# EasyEDA Pro project ProPrj_Dolphin 3D.epro, schematic Schematic1
Board Name: Main Board; Create Date: 2024-06-27; Page Name: P1; Project Name: Dolphin 3D; Schematic Name: Schematic1; Update Date: 2024-09-18
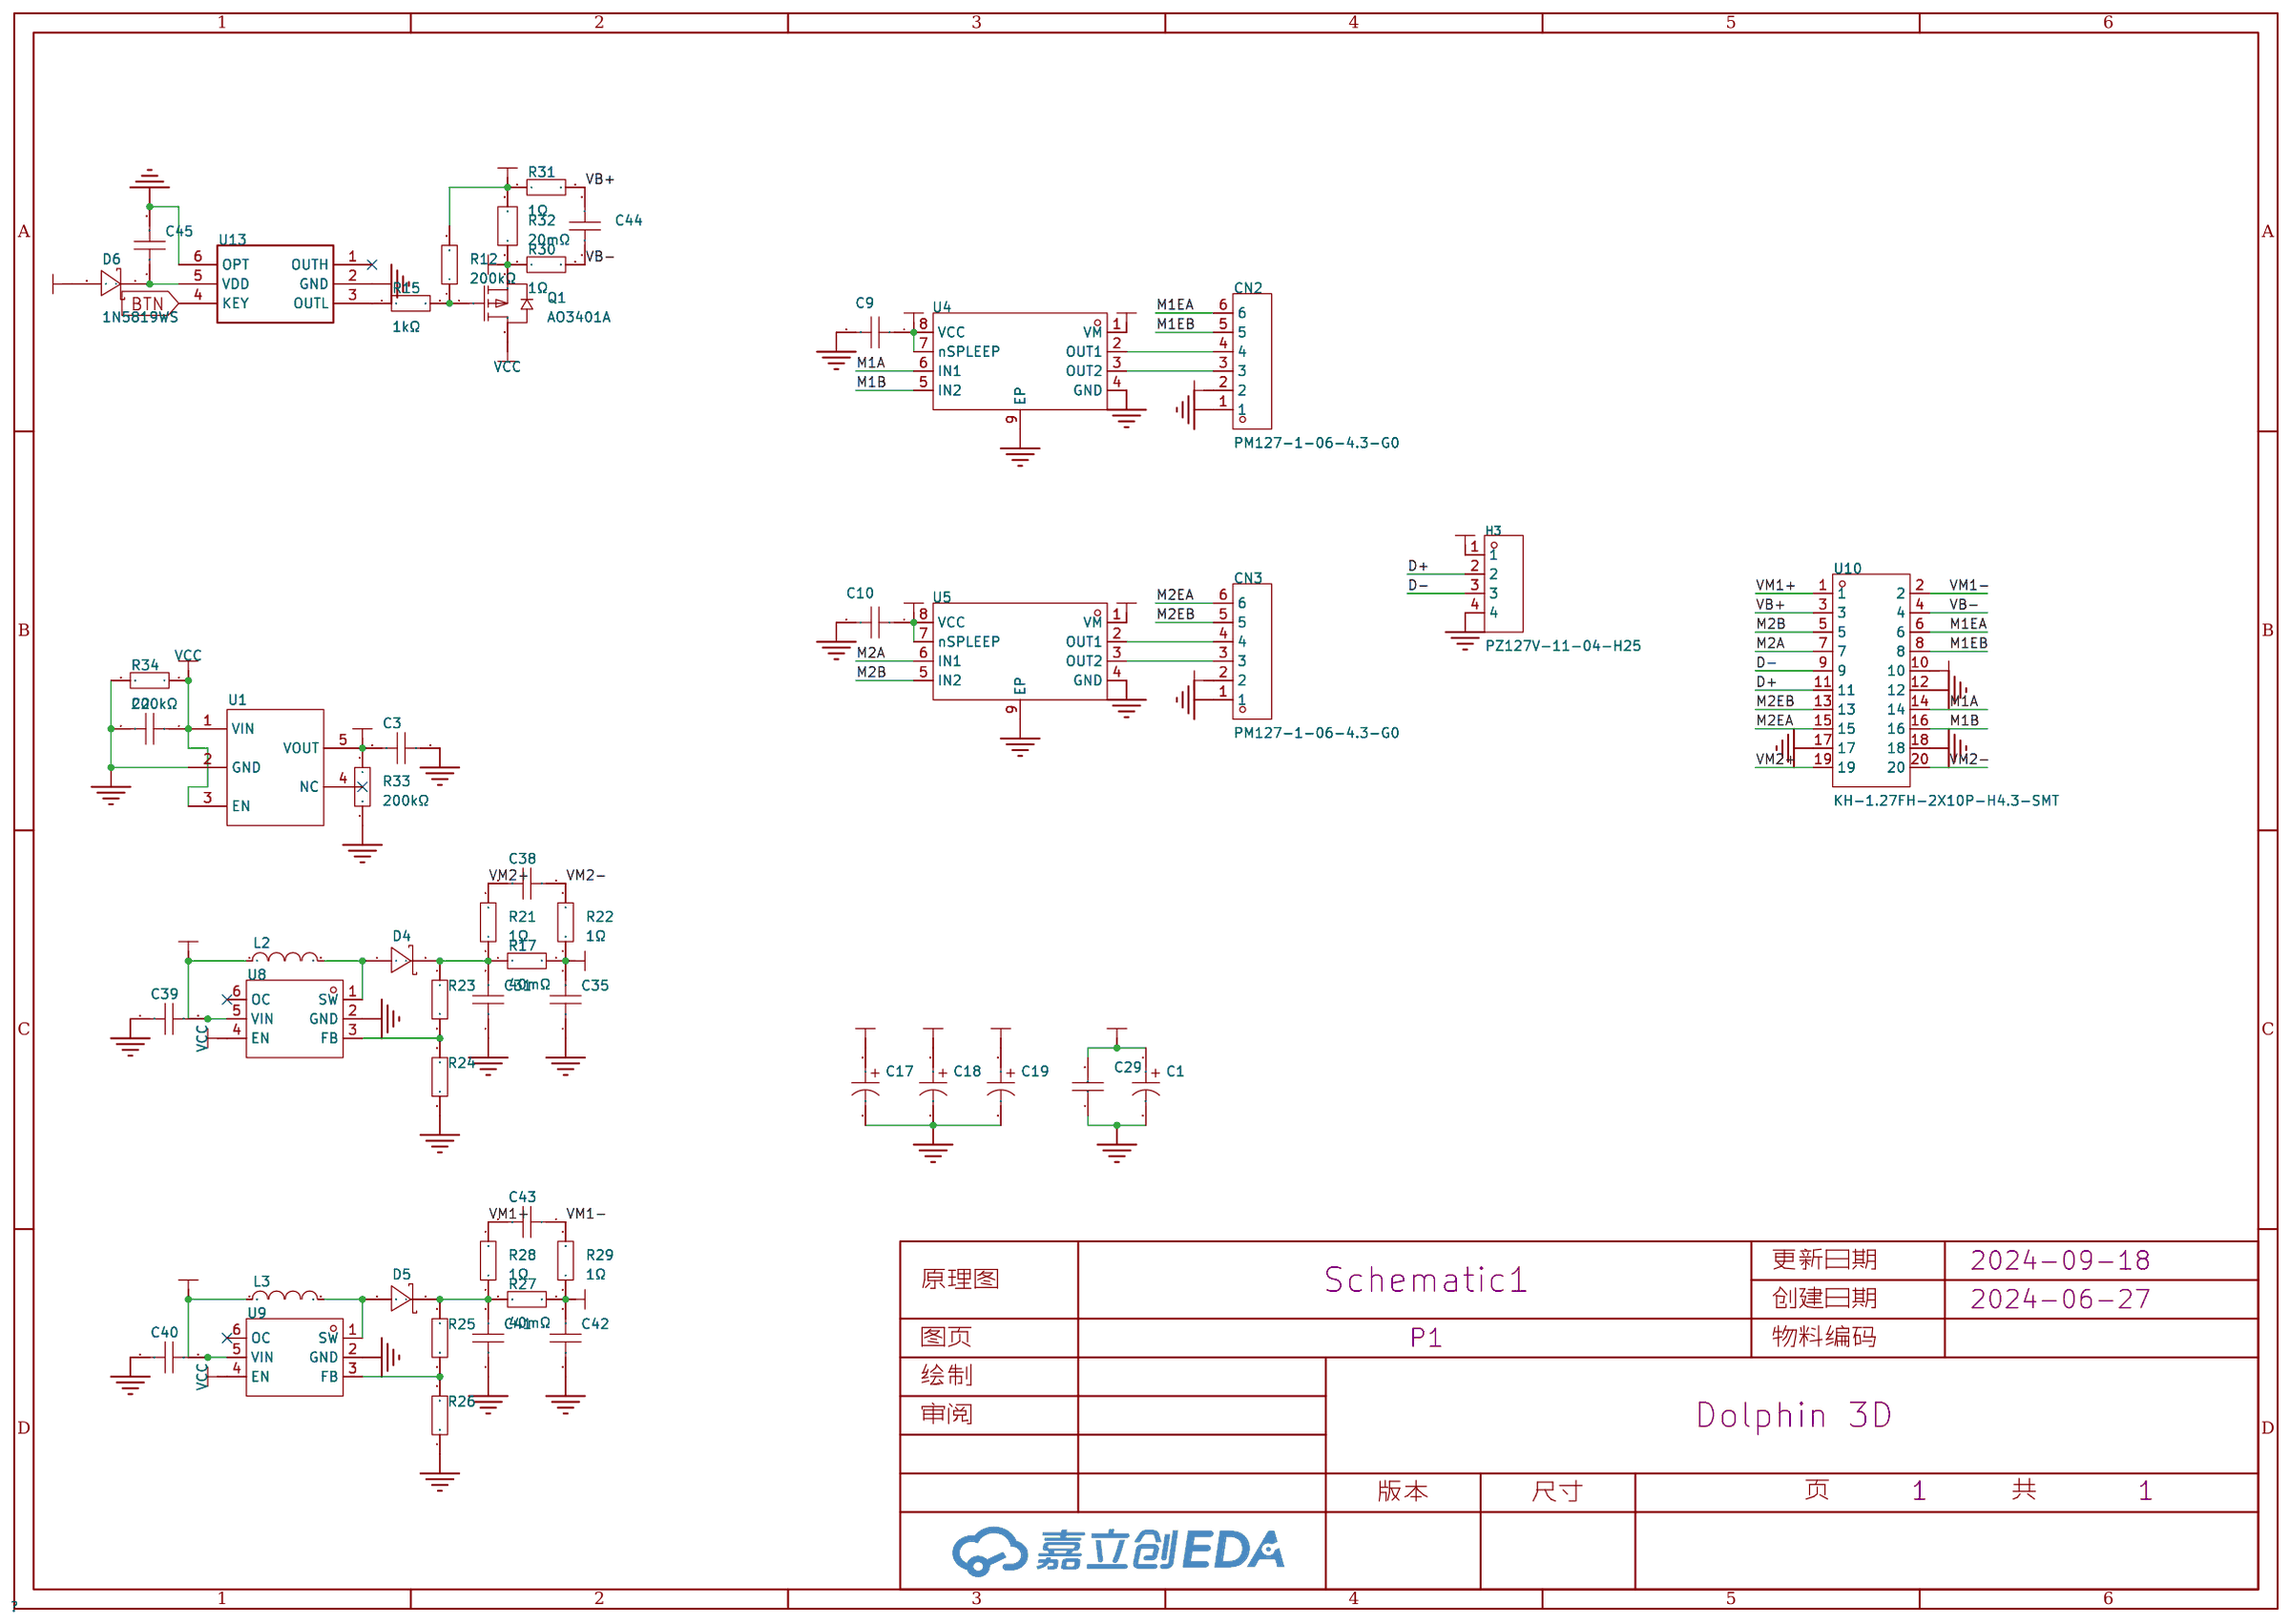
[diagram p0: schematic sheet]

## Parts
C1  470uF  [CAP-SMD_BD6.3-L6.6-W6.6-FD]
C2  1uF  [C0402]
C3  1uF  [C0402]
C9  100nF  [C0402]
C10  100nF  [C0402]
C17  470uF  [CAP-SMD_BD6.3-L6.6-W6.6-FD]
C18  470uF  [CAP-SMD_BD6.3-L6.6-W6.6-FD]
C19  470uF  [CAP-SMD_BD6.3-L6.6-W6.6-FD]
C29  100uF  [C1206]
C31  22uF  [C0805]
C35  22uF  [C0805]
C38  100nF  [C0402]
C39  22uF  [C0805]
C40  22uF  [C0805]
C41  22uF  [C0805]
C42  22uF  [C0805]
C43  100nF  [C0402]
C44  100nF  [C0402]
C45  10uF  [C0402]
CN2  PM127-1-06-4.3-G0  [HDR-TH_6P-P1.27-V-F]
CN3  PM127-1-06-4.3-G0  [HDR-TH_6P-P1.27-V-F]
D4  SS54  [SMA_L4.4-W2.8-LS5.4-R-RD]
D5  SS54  [SMA_L4.4-W2.8-LS5.4-R-RD]
D6  1N5819WS  [SOD-323_L1.8-W1.3-LS2.5-RD]
H3  PZ127V-11-04-H25  [HDR-TH_4P-P1.27-V-M]
L2  6.8uH  [IND-SMD_L4.0-W4.0_FNR4012S]
L3  6.8uH  [IND-SMD_L4.0-W4.0_FNR4012S]
Q1  AO3401A  [SOT-23_L2.9-W1.3-P1.90-LS2.4-BR]
R12  200kΩ  [R0402]
R15  1kΩ  [R0402]
R17  40mΩ  [R0805]
R21  1Ω  [R0402]
R22  1Ω  [R0402]
R23  174kΩ  [R0402]
R24  10kΩ  [R0402]
R25  174kΩ  [R0402]
R26  10kΩ  [R0402]
R27  40mΩ  [R0805]
R28  1Ω  [R0402]
R29  1Ω  [R0402]
R30  1Ω  [R0402]
R31  1Ω  [R0402]
R32  20mΩ  [R1206]
R33  200kΩ  [R0402]
R34  200kΩ  [R0402]
U1  RT9013-33GB  [SOT-23-5_L3.0-W1.7-P0.95-LS2.8-BL]
U4  DRV8837DSGR  [WSON-8_L2.0-W2.0-P0.50-TL-EP]
U5  DRV8837DSGR  [WSON-8_L2.0-W2.0-P0.50-TL-EP]
U8  MT3608L  [SOT-23-6_L2.9-W1.7-P0.95-LS2.8-BL]
U9  MT3608L  [SOT-23-6_L2.9-W1.7-P0.95-LS2.8-BL]
U10  KH-1.27FH-2X10P-H4.3-SMT  [CONN-SMD_20P-P1.27_KINGHELM_KH-1.27FH-2X10P-H4.3-SMT]
U13  -  [SOT-23-6_L2.9-W1.6-P0.95-LS2.8-BL]

## Library data of the parts
C1 C17-C19 = 126RV0010: 容值:470uF;精度:±20%;额定电压:16V;纹波电流:175mA@120Hz;等效串联电阻:-;; LCSC Part Name: 470uF ±20% 16V; Supplier Part: C5354997; Manufacturer: KNSCHA(科尼盛); Supplier Footprint: SMD,D6.3xL7.7mm; JLCPCB Part Class: Extended Part; Datasheet: https://atta.szlcsc.com/upload/public/pdf/source/20230206/6EACB8087E386B8E2A41225BA5FD94C3.pdf; Supplier: LCSC; Tolerance: ±20%; Rated Voltage: 16V; Ripple Current: 175mA@120Hz; φD: 6.3mm; L: 7.7mm; Lifetime @ Temp: 2000hrs@105; Operating Temperature: -55~+105
C2 C3 = CL05A105KA5NQNC: 容值:1uF;精度:±10%;额定电压:25V;材质(温度系数):X5R;; LCSC Part Name: 1uF ±10% 25V; Supplier Part: C52923; Manufacturer: SAMSUNG(三星); Supplier Footprint: 0402; JLCPCB Part Class: Basic Part; Datasheet: https://atta.szlcsc.com/upload/public/pdf/source/20160218/1457707763339.pdf; Supplier: LCSC; Tolerance: ±10%; Voltage Rated: 25V; Temperature Coefficient: X5R
C9 C10 C38 C43 C44 = CL05B104KB54PNC: 容值:100nF;精度:±10%;额定电压:50V;材质(温度系数):X7R;; LCSC Part Name: 100nF ±10% 50V; Supplier Part: C307331; Manufacturer: SAMSUNG(三星); Supplier Footprint: 0402; JLCPCB Part Class: Basic Part; Datasheet: https://atta.szlcsc.com/upload/public/pdf/source/20160218/1457707763339.pdf; Supplier: LCSC; Tolerance: ±10%; Voltage Rated: 50V; Temperature Coefficient: X7R
C29 = CL31A107MQHNNNE: 容值:100uF;精度:±20%;额定电压:6.3V;材质(温度系数):X5R;; LCSC Part Name: 100uF ±20% 6.3V; Supplier Part: C15008; Manufacturer: SAMSUNG(三星); Supplier Footprint: 1206; JLCPCB Part Class: Basic Part; Datasheet: https://atta.szlcsc.com/upload/public/pdf/source/20160218/1457707763339.pdf; Supplier: LCSC; Tolerance: ±20%; Voltage Rated: 6.3V; Temperature Coefficient: X5R
C31 C35 C39-C42 = CL21A226MAQNNNE: 容值:22uF;精度:±20%;额定电压:25V;材质(温度系数):X5R;; LCSC Part Name: 22uF ±20% 25V; Supplier Part: C45783; Manufacturer: SAMSUNG(三星); Supplier Footprint: 0805; JLCPCB Part Class: Basic Part; Datasheet: https://atta.szlcsc.com/upload/public/pdf/source/20160218/1457707763339.pdf; Supplier: LCSC; Tolerance: ±20%; Voltage Rated: 25V; Temperature Coefficient: X5R
C45 = CL05A106MQ5NUNC: 容值:10uF;精度:±20%;额定电压:6.3V;材质(温度系数):X5R;; LCSC Part Name: 10uF ±20% 6.3V; Supplier Part: C15525; Manufacturer: SAMSUNG(三星); Supplier Footprint: 0402; JLCPCB Part Class: Basic Part; Datasheet: https://atta.szlcsc.com/upload/public/pdf/source/20220823/2B02EE04F8F211D38A52DCB16EB6BEBA.pdf; Supplier: LCSC; Tolerance: ±20%; Voltage Rated: 6.3V; Temperature Coefficient: X5R
CN2 CN3 = PM127-1-06-4.3-G0: 插孔结构:1x6P;间距:1.27mm;行距:-;圆孔/方孔:方孔;安装类型:直插;排数:单排;总孔位数:6P;额定电流:1A;插孔方向:顶部;塑高:4.3mm;触头材质:磷青铜;工作温度范围:-40℃~+105℃;焊接温度(最大值):260℃@10S;; LCSC Part Name: 1x6P 间距:1.27mm 直插; Supplier Part: C5447364; Manufacturer: HCTL(华灿天禄); Supplier Footprint: 插件,P=1.27mm; JLCPCB Part Class: Extended Part; Datasheet: https://atta.szlcsc.com/upload/public/pdf/source/20230412/FDFD02C4BDBEFFD68C1CF22FAB47C8A5.pdf; Supplier: LCSC; Holes Structure: 1x6P; Pitch: 1.27mm; Circular Hole / Square Hole: 方孔; Mounting Type: 直插; Number of Rows: 单排; Number of Holes: 6P; Current Rating (Max): 1A; Holes Direction: 顶部; Insulation Height: 4.3mm; Contact Material: 磷青铜; Operating Temperature Range: -40℃~+105℃; Soldering Temperature(Max): 260℃@10S
D4 D5 = SS54_C22452: 二极管配置:独立式;正向压降(Vf):550mV@5A;直流反向耐压(Vr):40V;整流电流:5A;; LCSC Part Name: 电压:40V 电流:5A; Supplier Part: C22452; Manufacturer: MDD(辰达半导体); Supplier Footprint: SMA(DO-214AC); JLCPCB Part Class: Basic Part; Datasheet: https://atta.szlcsc.com/upload/public/pdf/source/20230314/529CD85F9B31F69841D3A079BC07E377.pdf; Supplier: LCSC; Diode Configuration: 独立式; Forward Voltage (Vf@If): 550mV@5A; Reverse Voltage (Vr): 40V; Rectified Current: 5A; Reverse Leakage Current (Ir): 1mA@40V; Average Rectified Current (Io): 5A
D6 = 1N5819WS_C191023: 正向压降(Vf):600mV@1A;直流反向耐压(Vr):40V;平均整流电流(Io):1A;; LCSC Part Name: 电压:40V 电流:1A; Supplier Part: C191023; Manufacturer: Hottech(合科泰); Supplier Footprint: SOD-323; JLCPCB Part Class: 基础库; Datasheet: https://atta.szlcsc.com/upload/public/pdf/source/20220428/3CB86FD8D28D653594B4E35F9D5AEFD9.pdf; Supplier: LCSC; Forward Voltage (Vf@If): 600mV@1A; Reverse Voltage (Vr): 40V; Average Rectified Current (Io): 1A
H3 = PZ127V-11-04-H25: 插针结构:1x4P;间距:1.27mm;行距:-;圆针/方针:方针;安装类型:直插;排数:单排;总PIN位数:4P;额定电流:1A;额定电压:-;配合针长度:2.9mm;塑高:2.5mm;端接针长度:2mm;触头材质:-;工作温度范围:-40℃~+105℃;颜色:黑色;; LCSC Part Name: 间距:1.27mm 1x4P 直插 方针; Supplier Part: C962328; Manufacturer: XFCN(兴飞); Supplier Footprint: 插件,P=1.27mm; JLCPCB Part Class: 扩展库; Datasheet: https://atta.szlcsc.com/upload/public/pdf/source/20201127/C962328_DAA4922208AAB130BB0C2B7AF8550114.pdf; Supplier: LCSC; Pin Structure: 1x4P; Pitch: 1.27mm; Circluar Pins/Square Pins: 方针; Mounting Type: 直插; Number of Rows: 单排; Number of Pins: 4P; Current Rating (Max): 1A; Length of Mating Pin: 2.9mm; Insulation Height: 2.5mm; Length of End Connection Pin: 2mm; Operating Temperature Range: -40℃~+105℃; Color: 黑色
L2 L3 = SMNR4030-6R8MT: 电感值:6.8uH;精度:±20%;额定电流:2.6A;饱和电流(Isat):2.6A;; LCSC Part Name: 6.8uH ±20% 2.6A; Supplier Part: C5307592; Manufacturer: SXN(顺翔诺); Supplier Footprint: SMD,4x4x3mm; JLCPCB Part Class: Extended Part; Datasheet: https://atta.szlcsc.com/upload/public/pdf/source/20210810/9B14FB057739B11AB42B77A310A3EA3C.pdf; Supplier: LCSC; Tolerance: ±20%; Rated Current: 2.6A; Saturation Current (Isat): 2.6A; DC Resistance (DCR): 115mΩ
Q1 = AO3401A_C15127: 类型:1个P沟道;漏源电压(Vdss):30V;连续漏极电流(Id):4A;功率(Pd):1.4W;导通电阻(RDS(on)@Vgs,Id):44mΩ@10V,4.3A;阈值电压(Vgs(th)@Id):1.3V@250uA;; LCSC Part Name: 1个P沟道 耐压:30V 电流:4A; Supplier Part: C15127; Manufacturer: AOS; Supplier Footprint: SOT-23; JLCPCB Part Class: 基础库; Datasheet: https://atta.szlcsc.com/upload/public/pdf/source/20160507/1462613609053.pdf; Supplier: LCSC; Type: 1个P沟道; Drain Source Voltage (Vdss): 30V; Continuous Drain Current (Id): 4A; Power Dissipation (Pd): 1.4W; Drain Source On Resistance (RDS(on)@Vgs,Id): 44mΩ@10V,4.3A; Gate Threshold Voltage (Vgs(th)@Id): 1.3V@250uA; Total Gate Charge (Qg@Vgs): 12.2nC@4.5V; Input Capacitance (Ciss@Vds): 1.2nF@15V; Operating Temperature: -55℃~+150℃@(Tj)
R12 R33 R34 = 0402WGF2003TCE: 电阻类型:厚膜电阻;阻值:200kΩ;精度:±1%;功率:62.5mW;最大工作电压:50V;温度系数:±100ppm/℃;; LCSC Part Name: 200kΩ ±1% 62.5mW 厚膜电阻; Supplier Part: C25764; Manufacturer: UNI-ROYAL(厚声); Supplier Footprint: 0402; JLCPCB Part Class: Basic Part; Datasheet: https://atta.szlcsc.com/upload/public/pdf/source/20200306/C422600_1E6D84923E4A46A82E41ADD87F860B5C.pdf; Supplier: LCSC; Type: 厚膜电阻; Tolerance: ±1%; Power(Watts): 62.5mW; Overload Voltage (Max): 50V; Temperature Coefficient: ±100ppm/℃; Operating Temperature Range: -55℃~+155℃
R15 = 0402WGF1001TCE: 电阻类型:厚膜电阻;阻值:1kΩ;精度:±1%;功率:62.5mW;最大工作电压:50V;温度系数:±100ppm/℃;; LCSC Part Name: 1kΩ ±1% 62.5mW 厚膜电阻; Supplier Part: C11702; Manufacturer: UNI-ROYAL(厚声); Supplier Footprint: 0402; JLCPCB Part Class: 基础库; Datasheet: https://atta.szlcsc.com/upload/public/pdf/source/20200306/C422600_1E6D84923E4A46A82E41ADD87F860B5C.pdf; Supplier: LCSC; Type: 厚膜电阻; Tolerance: ±1%; Power(Watts): 62.5mW; Overload Voltage (Max): 50V; Temperature Coefficient: ±100ppm/℃; Operating Temperature Range: -55℃~+155℃
R17 R27 = RL0805FR-070R04L: 电阻类型:厚膜电阻;阻值:40mΩ;精度:±1%;功率:125mW;温度系数:±1200ppm/℃;; LCSC Part Name: 40mΩ ±1% 125mW; Supplier Part: C326963; Manufacturer: YAGEO(国巨); Supplier Footprint: 0805; JLCPCB Part Class: 扩展库; Datasheet: https://atta.szlcsc.com/upload/public/pdf/source/20181031/C326963_8D78C6891AEEE4901E6622C888741967.pdf; Supplier: LCSC; Type: 厚膜电阻; Tolerance: ±1%; Power(Watts): 125mW; Temperature Coefficient: ±1200ppm/℃
R21 R22 R28-R31 = 0402WGF100KTCE: 电阻类型:厚膜电阻;阻值:1Ω;精度:±1%;功率:62.5mW;最大工作电压:50V;温度系数:±200ppm/℃;; LCSC Part Name: 1Ω ±1% 62.5mW 厚膜电阻; Supplier Part: C25086; Manufacturer: UNI-ROYAL(厚声); Supplier Footprint: 0402; JLCPCB Part Class: Extended Part; Datasheet: https://atta.szlcsc.com/upload/public/pdf/source/20200306/C422600_1E6D84923E4A46A82E41ADD87F860B5C.pdf; Supplier: LCSC; Type: 厚膜电阻; Tolerance: ±1%; Power(Watts): 62.5mW; Overload Voltage (Max): 50V; Temperature Coefficient: ±200ppm/℃; Operating Temperature Range: -55℃~+155℃
R23 R25 = 0402WGF1743TCE: 电阻类型:厚膜电阻;阻值:174kΩ;精度:±1%;功率:62.5mW;最大工作电压:50V;温度系数:±100ppm/;; LCSC Part Name: 174kΩ ±1% 62.5mW 厚膜电阻; Supplier Part: C26994; Manufacturer: UNI-ROYAL(厚声); Supplier Footprint: 0402; JLCPCB Part Class: Extended Part; Datasheet: https://atta.szlcsc.com/upload/public/pdf/source/20200306/C422600_1E6D84923E4A46A82E41ADD87F860B5C.pdf; Supplier: LCSC; Type: 厚膜电阻; Tolerance: ±1%; Power(Watts): 62.5mW; Overload Voltage (Max): 50V; Temperature Coefficient: ±100ppm/; Operating Temperature Range: -55~+155
R24 R26 = 0402WGF1002TCE: 电阻类型:厚膜电阻;阻值:10kΩ;精度:±1%;功率:62.5mW;最大工作电压:50V;温度系数:±100ppm/;; LCSC Part Name: 10kΩ ±1% 62.5mW 厚膜电阻; Supplier Part: C25744; Manufacturer: UNI-ROYAL(厚声); Supplier Footprint: 0402; JLCPCB Part Class: Basic Part; Datasheet: https://atta.szlcsc.com/upload/public/pdf/source/20200306/C422600_1E6D84923E4A46A82E41ADD87F860B5C.pdf; Supplier: LCSC; Type: 厚膜电阻; Tolerance: ±1%; Power(Watts): 62.5mW; Overload Voltage (Max): 50V; Temperature Coefficient: ±100ppm/; Operating Temperature Range: -55~+155
R32 = HoLR1206-1W-20mR-1%-75ppm: 电阻类型:采样电阻;阻值:20mΩ;精度:±1%;功率:1W;温度系数:±75ppm/℃;安装方式:贴片;; LCSC Part Name: 20mΩ ±1% 1W; Supplier Part: C601099; Manufacturer: Milliohm(毫欧); Supplier Footprint: 1206; JLCPCB Part Class: 扩展库; Datasheet: https://atta.szlcsc.com/upload/public/pdf/source/20200610/C601099_2DC4AC9FED816D37D0E28A923DFC7775.pdf; Supplier: LCSC; Type: 采样电阻; Tolerance: ±1%; Power(Watts): 1W; Temperature Coefficient: ±75ppm/℃; Mounting Sytle: 贴片
U1 = RT9013-33GB: 输出类型:固定;最大输入电压:5.5V;输出电压:3.3V;最大输出电流:500mA;电源纹波抑制比(PSRR):50dB@(10kHz);输出极性:正极;; LCSC Part Name: 输入5.5V 输出3.3V 500mA; Supplier Part: C47773; Manufacturer: RICHTEK(立锜); Supplier Footprint: SOT-23-5; JLCPCB Part Class: Extended Part; Datasheet: https://atta.szlcsc.com/upload/public/pdf/source/20150504/1457707282459.pdf; Supplier: LCSC; Output Type: 固定; Maximum Input Voltage: 5.5V; Output Voltage: 3.3V; MAX Output Current: 500mA; Power Supply Rejection Ratio (PSRR): 50dB@(10kHz); Dropout Voltage: 400mV@(500mA); standby current: 50uA; Operating Temperature: -40~+85; Output Polarity: 正极; Number of Outputs: 1
U4 U5 = DRV8837DSGR: 驱动电机类型:有刷直流电机;电源电压:1.8V~7V;输出电流:1.8A;接口:PWM;; LCSC Part Name: 1.8A 有刷直流电机驱动芯片 7V; Supplier Part: C39159; Manufacturer: TI(德州仪器); Supplier Footprint: WSON-8-EP(2x2); JLCPCB Part Class: Extended Part; Datasheet: https://www.ti.com/cn/lit/gpn/drv8837; Supplier: LCSC; Drive motor type: 有刷直流电机; Supply Voltage: 1.8V~7V; Output Current: 1.8A; Interface: PWM; Operating Temperature: -40~+85@(Ta)
U8 U9 = MT3608L: 功能类型:升压型;输入电压:2V~24V;输出电压:28V;输出电流(最大值):-;; Supplier Part: C2932326; Manufacturer: 西安航天民芯; Supplier Footprint: SOT-23-6; JLCPCB Part Class: Extended Part; Datasheet: https://atta.szlcsc.com/upload/public/pdf/source/20211213/953A62CC1033762E00AABAD4906DD7F1.pdf; Supplier: LCSC; Function: 升压型; Input Voltage: 2V~24V; Output Voltage: 28V; Switching Frequency: 1.2MHz; Number of Outputs: 1; Topology: 升压式; Switch tube (built-in/external): 内置
U10 = KH-1.27FH-2X10P-H4.3-SMT: 插孔结构:2x10P;间距:1.27mm;行距:1.27mm;圆孔/方孔:方孔;安装类型:立贴;排数:双排;总孔位数:20P;额定电流:1A;额定电压:-;插孔方向:顶部;塑高:4.3mm;工作温度范围:-40℃~+105℃;; LCSC Part Name: 间距:1.27mm 2x10P 立贴; Supplier Part: C2938399; Manufacturer: kinghelm(金航标); Supplier Footprint: SMD,P=1.27mm; JLCPCB Part Class: 扩展库; Datasheet: https://atta.szlcsc.com/upload/public/pdf/source/20211228/9EED874CCD66E53FBD3960CA18E93ED0.pdf; Supplier: LCSC; Holes Structure: 2x10P; Pitch: 1.27mm; Row Spacing: 1.27mm; Circular Hole / Square Hole: 方孔; Mounting Type: 立贴; Number of Rows: 双排; Number of Holes: 20P; Current Rating (Max): 1A; Holes Direction: 顶部; Insulation Height: 4.3mm; Operating Temperature Range: -40℃~+105℃
U13 = HOKEC 0339D: 济南宏科 开关机芯片

## Nets
+3V3: C3.1 C9.1 C10.1 C19.1 CN2.2 CN3.2 R33.1 U1.5(VOUT) U4.7(nSPLEEP) U4.8(VCC) U5.7(nSPLEEP) U5.8(VCC) U10.10
GND: C1.2 C2.2 C3.2 C9.2 C10.2 C17.2 C18.2 C19.2 C29.1 C31.1 C35.1 C39.1 C40.1 C41.1 C42.1 C45.2 CN2.1 CN3.1 H3.4 R24.1 R26.1 R33.2 R34.2 U1.2(GND) U4.4(GND) U4.9(EP) U5.4(GND) U5.9(EP) U8.2(GND) U9.2(GND) U10.12 U10.17 U10.18 U13.2(GND) U13.6(OPT)
VCC: C2.1 Q1.3(D) R34.1 U1.1(VIN) U1.3(EN) U8.4(EN) U9.4(EN)
+VM1: C17.1 C42.2 R27.2 R29.1 U4.1(VM)
+VM2: C18.1 C35.2 R17.2 R22.1 U5.1(VM)
BAT: D6.2(A) R12.2 R31.1 R32.2
BTN: U13.4(KEY)
D+: H3.2 U10.11
D-: H3.3 U10.9
M1A: U4.6(IN1) U10.14
M1B: U4.5(IN2) U10.16
M1EA: CN2.6 U10.6
M1EB: CN2.5 U10.8
M2A: U5.6(IN1) U10.7
M2B: U5.5(IN2) U10.5
M2EA: CN3.6 U10.15
M2EB: CN3.5 U10.13
VB+: C44.2 R31.2 U10.3
VB-: C44.1 R30.2 U10.4
VM1+: C43.2 R28.2 U10.1
VM1-: C43.1 R29.2 U10.2
VM2+: C38.2 R21.2 U10.19
VM2-: C38.1 R22.2 U10.20
VPOW: C1.1 C29.2 C39.2 C40.2 H3.1 L2.1 L3.1 Q1.2(S) R30.1 R32.1 U8.5(VIN) U9.5(VIN)
$1N5624: Q1.1(G) R12.1 R15.2
$1N6475: D4.1(A) L2.2 U8.1(SW)
$1N6476: C31.2 D4.2(K) R17.1 R21.1 R23.1
$1N7010: D5.1(A) L3.2 U9.1(SW)
$1N7011: C41.2 D5.2(K) R25.1 R27.1 R28.1
$1N9610: CN2.4 U4.2(OUT1)
$1N9613: CN2.3 U4.3(OUT2)
$1N9728: CN3.4 U5.2(OUT1)
$1N9730: CN3.3 U5.3(OUT2)
$1N12478: R23.2 R24.2 U8.3(FB)
$1N12591: R25.2 R26.2 U9.3(FB)
$1N20656: C45.1 D6.1(K) U13.5(VDD)
$1N20702: R15.1 U13.3(OUTL)

Not connected (* = marked no-connect by the designer): U1 4(NC)*; U8 6(OC)*; U9 6(OC)*; U13 1(OUTH)*
